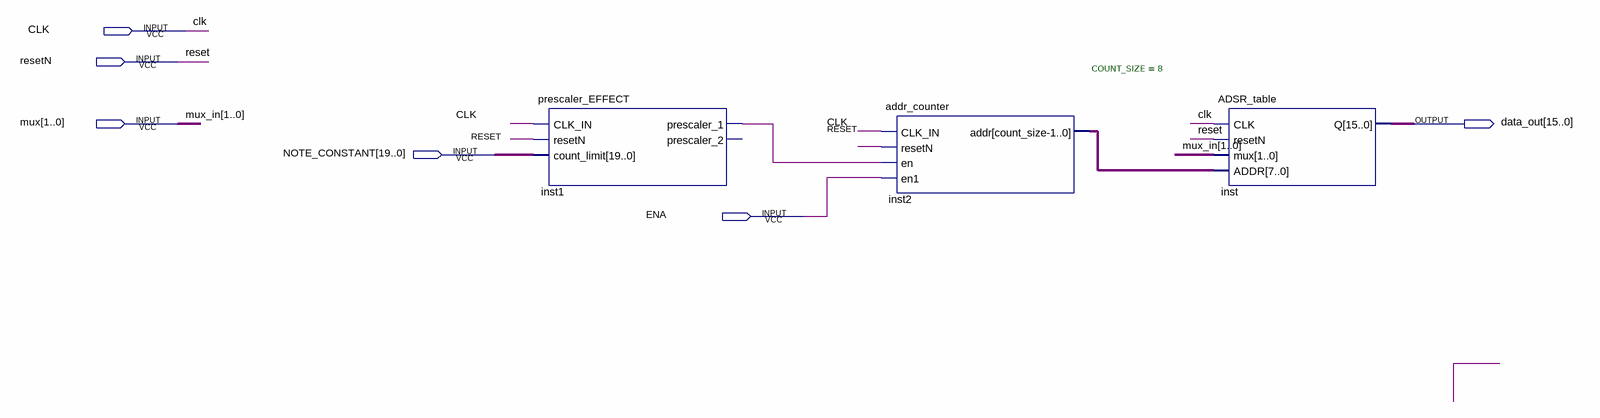
[diagram p0: schematic sheet]
// Quartus schematic effect_adsr.bdf as structural Verilog: 3 symbols, 6 pins
module effect_adsr (
  input  CLK,
  input  resetN,
  input  [1:0] mux,
  input  [19:0] NOTE_CONSTANT,
  input  ENA,
  output [15:0] data_out
);

  wire inst1_prescaler_1;
  wire [7:0] inst2_addr;

  prescaler_EFFECT inst1 (
    .CLK_IN(CLK), .resetN(resetN), .count_limit(NOTE_CONSTANT), .prescaler_1(inst1_prescaler_1));  // open: prescaler_2
  addr_counter #(.COUNT_SIZE(8)) inst2 (
    .CLK_IN(CLK), .resetN(resetN), .en(inst1_prescaler_1), .en1(ENA), .addr(inst2_addr));
  ADSR_table inst (.CLK(CLK), .resetN(resetN), .mux(mux), .ADDR(inst2_addr), .Q(data_out));

  // Other names for the same wires on the sheet: mux_in[1:0] = mux; reset = resetN
endmodule
